# EAGLE design OpampTestBoard (EAGLE 6.5.0)
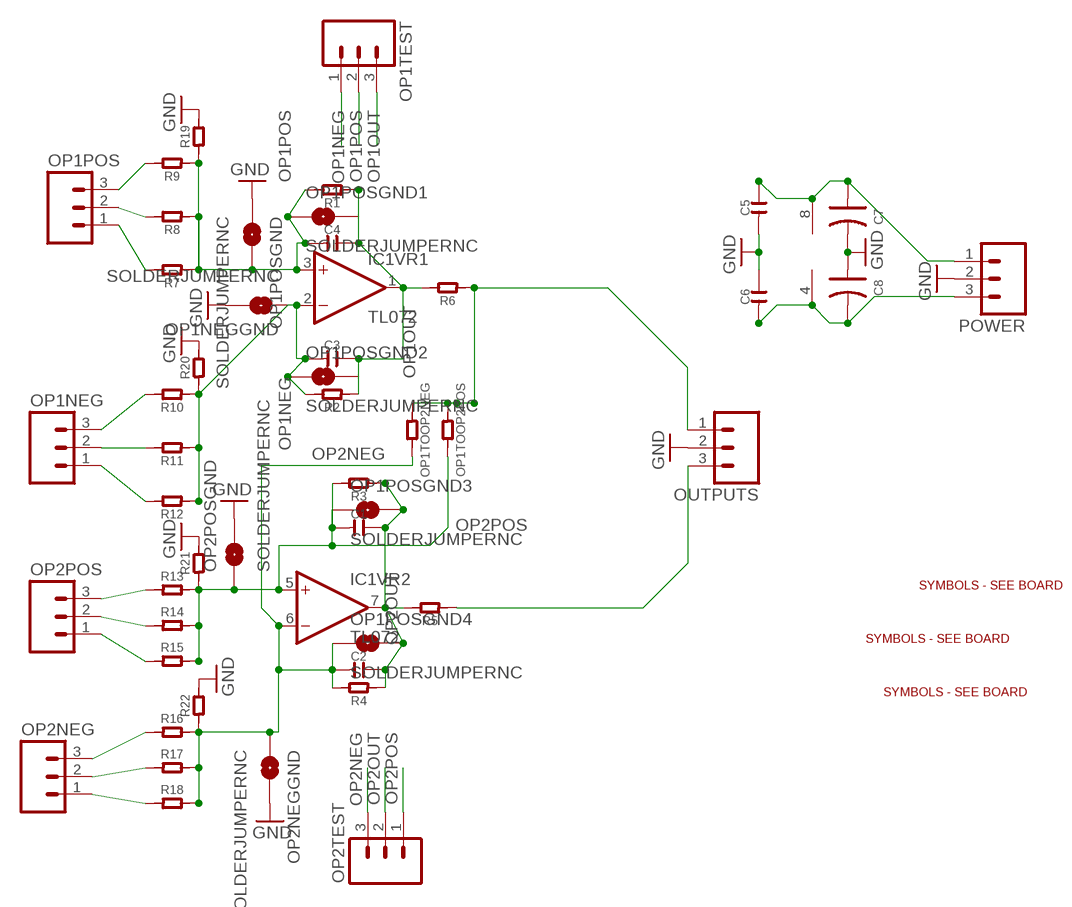
[diagram p0: schematic, sheet 1]

## Parts
C1  C-0805  [C0805]
C2  C-0805  [C0805]
C3  C-0805  [C0805]
C4  C-0805  [C0805]
C5  C-0805  [C0805]
C6  C-0805  [C0805]
C7  C-POLAR-A  [AVX-A]
C8  C-POLAR-A  [AVX-A]
IC1  TL072  [SO08]
OP1NEG  M03PTH  [1X03]
OP1NEGGND  SOLDERJUMPERNC  [SJ_2S]
OP1POS  M03PTH  [1X03]
OP1POSGND  SOLDERJUMPERNC  [SJ_2S]
OP1POSGND1  SOLDERJUMPERNC  [SJ_2S]
OP1POSGND2  SOLDERJUMPERNC  [SJ_2S]
OP1POSGND3  SOLDERJUMPERNC  [SJ_2S]
OP1POSGND4  SOLDERJUMPERNC  [SJ_2S]
OP1TEST  M03PTH  [1X03]
OP1TOOP2NEG  R-0603  [R0603]
OP1TOOP2POS  R-0603  [R0603]
OP2NEG  M03PTH  [1X03]
OP2NEGGND  SOLDERJUMPERNC  [SJ_2S]
OP2POS  M03PTH  [1X03]
OP2POSGND  SOLDERJUMPERNC  [SJ_2S]
OP2TEST  M03PTH  [1X03]
OUTPUTS  M03PTH  [1X03]
POWER  M03PTH  [1X03]
R1  R-0603  [R0603]
R2  R-0603  [R0603]
R3  R-0603  [R0603]
R4  R-0603  [R0603]
R5  R-0603  [R0603]
R6  R-0603  [R0603]
R7  R-0603  [R0603]
R8  R-0603  [R0603]
R9  R-0603  [R0603]
R10  R-0603  [R0603]
R11  R-0603  [R0603]
R12  R-0603  [R0603]
R13  R-0603  [R0603]
R14  R-0603  [R0603]
R15  R-0603  [R0603]
R16  R-0603  [R0603]
R17  R-0603  [R0603]
R18  R-0603  [R0603]
R19  R-0603  [R0603]
R20  R-0603  [R0603]
R21  R-0603  [R0603]
R22  R-0603  [R0603]
U$1  SYMBOLSOPAMP  [SYMB_OPAMP]
U$2  R2  SYMBOLSRESISTOR  [RESISTOR]
U$3  R1  SYMBOLSRESISTOR  [RESISTOR]

## Nets
GND: C5.1 C6.2 C7.- C8.+ OP1NEGGND.2 OP1POSGND.1 OP2NEGGND.2 OP2POSGND.2 OUTPUTS.2 POWER.2 R19.2 R20.2 R21.2 R22.2
N$1: OP1POS.3 R9.2
N$2: OP1TOOP2NEG.1 OP1TOOP2POS.1 OUTPUTS.1 R6.1
N$3: OP1POS.2 R8.2
N$4: OUTPUTS.3 R5.1
N$7: OP1POS.1 R7.2
N$8: OP1NEG.3 R10.2
N$9: OP1NEG.2 R11.2
N$10: OP1NEG.1 R12.2
N$11: OP2POS.3 R13.1
N$12: OP2POS.2 R14.1
N$13: OP2POS.1 R15.1
N$14: OP2NEG.3 R16.1
N$15: OP2NEG.2 R17.1
N$16: OP2NEG.1 R18.1
OP1NEG: C3.1 IC1.2(VR1:-IN) OP1NEGGND.1 OP1POSGND2.1 OP1TEST.1 R2.2 R10.1 R11.1 R12.1 R20.1
OP1OUT: C3.2 C4.2 IC1.1(VR1:OUT) OP1POSGND1.2 OP1POSGND2.2 OP1TEST.3 R1.1 R2.1 R6.2
OP1POS: C4.1 IC1.3(VR1:+IN) OP1POSGND1.1 OP1POSGND.2 OP1TEST.2 R1.2 R7.1 R8.1 R9.1 R19.1
OP2NEG: C2.1 IC1.6(VR2:-IN) OP1POSGND4.1 OP1TOOP2NEG.2 OP2NEGGND.1 OP2TEST.3 R4.2 R16.2 R17.2 R18.2 R22.1
OP2OUT: C1.2 C2.2 IC1.7(VR2:OUT) OP1POSGND3.2 OP1POSGND4.2 OP2TEST.2 R3.1 R4.1 R5.2
OP2POS: C1.1 IC1.5(VR2:+IN) OP1POSGND3.1 OP1TOOP2POS.2 OP2POSGND.1 OP2TEST.1 R3.2 R13.2 R14.2 R15.2 R21.1
VNEG: C6.1 C8.- IC1.4(VR3:V-) POWER.3
VPOS: C5.2 C7.+ IC1.8(VR3:V+) POWER.1

## Library data of the parts
C1-C6 = OPL:C*
C7 C8 = OPL:C-POLAR*
IC1 = EurorackModularParts:TL072
OP1NEG OP1POS OP1TEST OP2NEG OP2POS OP2TEST OUTPUTS POWER = SparkFun-Connectors:M03: Header 3 Standard 3-pin 0.1" header. Use with straight break away headers (SKU : PRT-00116), right angle break away headers (PRT-00553), swiss pins (PRT-00743), machine pins (PRT-00117), and female headers (PRT-00115). Molex polarized connector foot print use with SKU : PRT-08232 with associated crimp pins and housings.
OP1NEGGND OP1POSGND OP1POSGND1-OP1POSGND4 OP2NEGGND OP2POSGND = SparkFun-Passives:SOLDERJUMPER: Solder Jumper Standard SMD solder jumper. Used to automate production. Two varients : Normally Open and Normally Closed are the same, but have different paste layers. NC will have a large amount of paste and should jumper during reflow.
OP1TOOP2NEG OP1TOOP2POS R1-R22 = OPL:R*
U$1-U$3 = EurorackModularParts:SYMBOLS

## Board
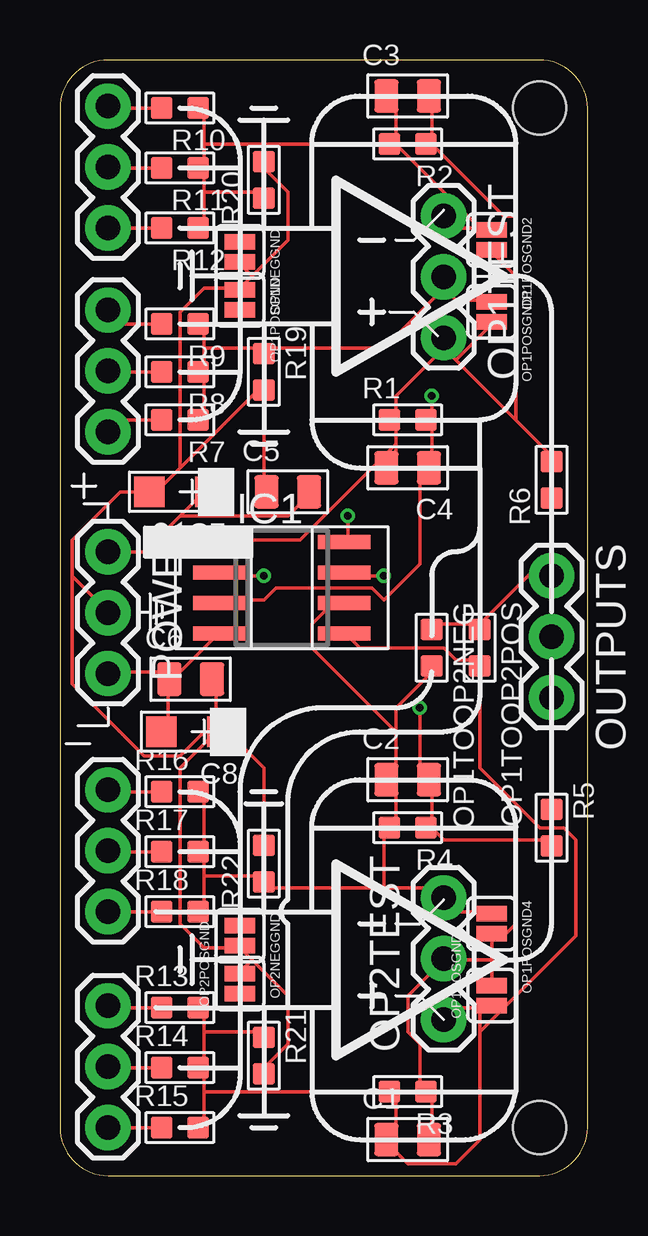
[diagram p1: board, top side]
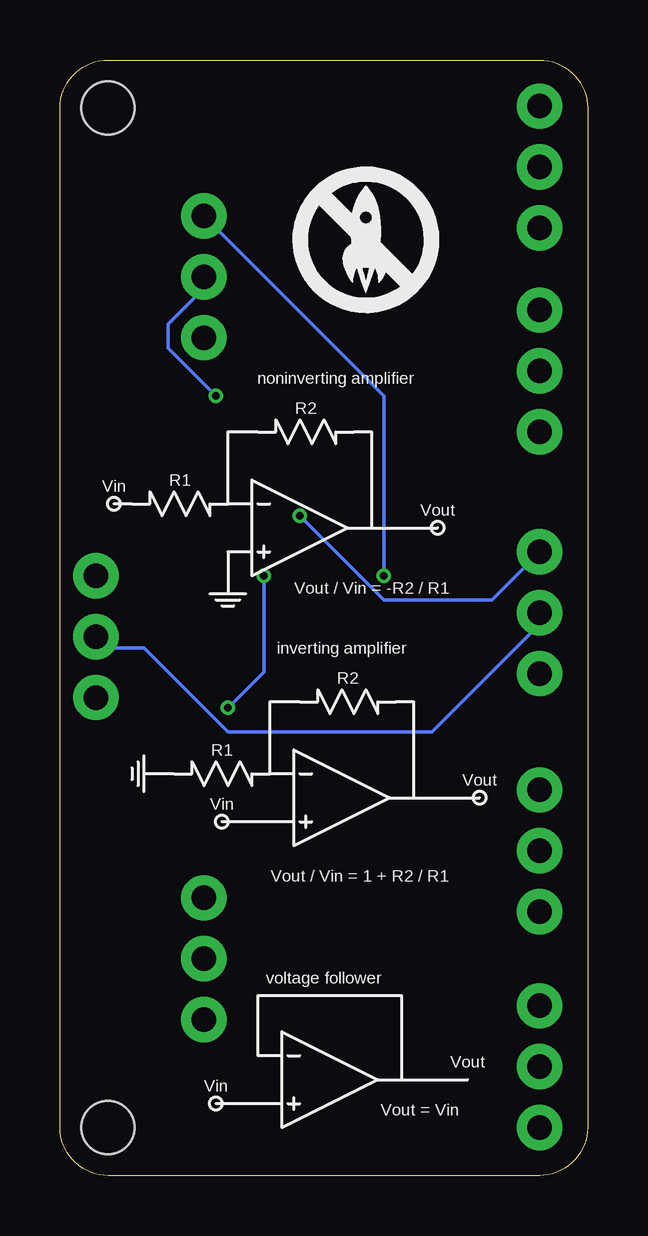
[diagram p2: board, bottom side, seen from below]

Size 22 x 46.5 mm. Coordinates in mm from the lower left corner, seen from the top.
Outline: 0,44.5 0,2 arc90 2,0 20,0 arc90 22,2 22,44.5 arc90 20,46.5 2,46.5 arc90 0,44.5
Copper layers (1*16): Top 0.035mm / dielectric 1.5mm / Bottom 0.035mm
Design rules "ITEADstudio_DRC": minimum track width 6mil, minimum drill 12mil, track to track 6mil, track to pad 6mil, pad to pad 6mil, via to via 6mil, smd to smd 0mil, copper to edge 10mil, drill to drill 10mil, minimum pad ring 10mil, minimum via ring 6mil, stop-mask expansion 2mil, vias tented up to drill 100mil, thermal gap 10mil
Holes 2.2 mm at 20,44.5 20,2

### Footprints (pad centres in the part's own frame; a part is rotated, then mirrored left to right if it is on the bottom)
C0805 = smd 1.016 x 1.397: 1 -0.889,0; 2 0.889,0
AVX-A = smd 1.27 x 1.27: + -1.27,0; - 1.27,0
SO08 = smd 0.6 x 2.2: 1 -1.905,-2.6; 2 -0.635,-2.6; 3 0.635,-2.6; 4 1.905,-2.6; 5 1.905,2.6; 6 0.635,2.6; 7 -0.635,2.6; 8 -1.905,2.6
1X03 = drill 1.016 pad 1.88: 1 0,0; 2 2.54,0; 3 5.08,0
SJ_2S = smd 0.635 x 1.27: 1 -0.412,0; 2 0.412,0
R0603 = smd 0.889 x 0.889: 1 -0.762,0; 2 0.762,0

### Placement (x,y rotation side)
C1  14.5,1.5 0 top
C2  14.5,16.5 0 top
C3  14.5,45 0 top
C4  14.5,29.5 180 top
C5  9.5,28.5 0 top
C6  5.45,20.69 0 top
C7  5,28.5 180 top
C8  5.5,18.5 180 top
IC1  9.25,24.5 270 top
OP1NEG  2,39.5 90 top
OP1NEGGND  7.5,38.5 270 top
OP1POS  2,31 90 top
OP1POSGND  7.5,36.5 270 top
OP1POSGND1  18,36 270 top
OP1POSGND2  18,39 270 top
OP1POSGND3  18,7.5 90 top
OP1POSGND4  18,10.5 270 top
OP1TEST  16,40 270 top
OP1TOOP2NEG  15.5,22 270 top
OP1TOOP2POS  17.5,22 270 top
OP2NEG  2,11 90 top
OP2NEGGND  7.5,10 270 top
OP2POS  2,2 90 top
OP2POSGND  7.5,8 90 top
OP2TEST  16,6.5 90 top
OUTPUTS  20.5,25 270 top
POWER  2,26 270 top
R1  14.5,31.5 0 top
R2  14.5,43 180 top
R3  14.5,3.5 180 top
R4  14.5,14.5 180 top
R5  20.5,14.5 270 top
R6  20.5,29 90 top
R7  5,31.5 180 top
R8  5,33.5 180 top
R9  5,35.5 180 top
R10  5,44.5 180 top
R11  5,42 180 top
R12  5,39.5 180 top
R13  5,7 0 top
R14  5,4.5 0 top
R15  5,2 0 top
R16  5,16 0 top
R17  5,13.5 0 top
R18  5,11 0 top
R19  8.5,33.5 270 top
R20  8.5,41.5 90 top
R21  8.5,5 270 top
R22  8.5,13 90 top
U$1  14,27 0 bottom
U$2  11.75,31 0 bottom
U$3  17,28 0 bottom
U$4  SYMBOLSOPAMP  [SYMB_OPAMP]  12.25,15.75 0 bottom
U$5  R2  [RESISTOR]  10,19.75 0 bottom
U$6  R1  [RESISTOR]  15.25,16.75 0 bottom
U$7  SYMBOLSOPAMP  [SYMB_OPAMP]  12.75,4 0 bottom
U$8  [SMALLROCKET-SILKONLY]  9.25,39 0 bottom

### Tracks (layer width: path | path; a pad name or v marks a point on that pad's centre or on a via)
GND
  Top 0.152: 7.5,9.5 8,9 | 8,9 9.5,7.5 9.5,5.5 8.5,4.5 R21.2 | 8,9 7.5,8.5 OP2POSGND.2 | R22.2 8.5,17 7,18.5 C8.+ 6.5,18.5 | 6.5,18.5 6.5,20.5 C6.2 | 7.5,9.5 6,9.5 5,10.5 5,17 6.5,18.5 | 7.5,9.5 OP2NEGGND.2 | 7.5,37 8,37.5 | 8,37.5 9.5,39 9.5,41 8.5,42 R20.2 | 8,37.5 7.5,38 OP1NEGGND.2 | C5.1 8.5,28.5 R19.2 8.5,33 5,29.5 | 5,29.5 4,28.5 C7.- 2.5,28.5 0.5,26.5 0.5,25 | 7.5,37 6,37 5,36 5,29.5 | 7.5,37 OP1POSGND.1 | 0.5,25 2,23.5 POWER.2 | 6.5,18.5 6,18.5 5,17.5 3.5,17.5 0.5,20.5 0.5,25
  Bottom 0.152: OUTPUTS.2 20.5,22 18.5,22 15,18.5 6.5,18.5 2,23 POWER.2
N$1
  Top 0.152: R9.2 2.5,35.5 2,36 OP1POS.3
N$2
  Top 0.152: 17.5,23 15.5,23 OP1TOOP2NEG.1 | OUTPUTS.1 20.5,26 | 20.5,26 R6.1 | 20.5,26 17.5,23 | 17.5,23 OP1TOOP2POS.1
N$3
  Top 0.152: R8.2 2,33.5 OP1POS.2
N$4
  Top 0.152: OUTPUTS.3 R5.1
N$7
  Top 0.152: R7.2 2.5,31.5 OP1POS.1
N$8
  Top 0.152: R10.2 2,44.5 OP1NEG.3
N$9
  Top 0.152: R11.2 2,42 OP1NEG.2
N$10
  Top 0.152: OP1NEG.1 R12.2
N$11
  Top 0.152: R13.1 2,7 OP2POS.3
N$12
  Top 0.152: R14.1 2,4.5 OP2POS.2
N$13
  Top 0.152: OP2POS.1 R15.1
N$14
  Top 0.152: R16.1 2,16 OP2NEG.3
N$15
  Top 0.152: R17.1 2,13.5 OP2NEG.2
N$16
  Top 0.152: OP2NEG.1 R18.1
OP1NEG  (via drill 0.3)
  Top 0.152: 6,42 6,41 | 6,41 6,39.5 R12.1 | 6,41 7.5,41 | 7.5,41 8.5,41 R20.1 | 6,42 6,43 | 6,43 6,44.5 R10.1 | 6,42 R11.1 | 7.5,41 OP1NEGGND.1 | 14,43 14,45 C3.1 | 17.5,39.5 16.5,39.5 OP1TEST.1 | 17.5,39.5 18,39.5 OP1POSGND2.1 17.5,39.5 | 17.5,39.5 14,43 | 14,43 R2.2 6,43 | v8.5,25 7,25 IC1.2
  Bottom 0.152: v8.5,25 8.5,32.5 OP1TEST.1
OP1OUT
  Top 0.152: 15.5,43 15.5,45 C3.2 | 14,30.5 14,29.5 C4.2 | 14,30.5 14,31.5 | 16,34.5 16.5,34 | 16.5,34 19,31.5 | 19,31.5 20.5,30 R6.2 | 16.5,34 18,35.5 OP1POSGND1.2 | 19,37.5 18,38.5 OP1POSGND2.2 | 19,31.5 19,37.5 | 14,31.5 14,32.5 16,34.5 | 14,31.5 R1.1 | 16,34.5 OP1TEST.3 | 15.5,43 18.5,40 19,40 19,37.5 | 15.5,43 R2.1 | 14,30.5 10,26.5 7,26.5 IC1.1
OP1POS  (via drill 0.3)
  Top 0.152: 15.5,31.5 15.5,29.5 C4.1 15,29.5 15,25.5 13.5,24 13,24.5 9,24.5 8.5,24 7,24 IC1.3 | 6,33.5 6,31.5 R7.1 | 6,33.5 6,34.5 | 6,34.5 6,35.5 R9.1 | 6,33.5 R8.1 | 6,34.5 7.5,34.5 | 7.5,34.5 8.5,34.5 | 7.5,34.5 OP1POSGND.2 | 16,37 16.5,36.5 18,36.5 OP1POSGND1.1 | 8.5,34.5 13.5,34.5 16,37 | 8.5,34.5 R19.1 | 16,37 OP1TEST.2 | v15.5,32.5 15.5,31.5 | 15.5,31.5 R1.2
  Bottom 0.152: v15.5,32.5 17.5,34.5 17.5,35.5 16,37 OP1TEST.2
OP2NEG
  Top 0.152: 14,16.5 14,14.5 R4.2 13.5,14.5 13.5,12 | 14,16.5 14,18.5 | 14,18.5 14,19.5 15.5,21 OP1TOOP2NEG.2 | 14,16.5 C2.1 | 14,18.5 10.5,22 10.5,23 11.5,24 IC1.6 | 6,13.5 6,12.5 | 6,12.5 6,11 R18.2 | 6,12.5 7.5,12.5 | 7.5,12.5 8.5,12.5 R22.1 8.5,12 13.5,12 | 6,13.5 6,16 R16.2 | 6,13.5 R17.2 | 7.5,12.5 OP2NEGGND.1 | OP1POSGND4.1 18,11 16.5,11 16,11.5 OP2TEST.3 16,12 13.5,12
OP2OUT  (via drill 0.3)
  Top 0.152: 18,10 18,9 | 18,9 OP1POSGND3.2 | C1.2 15.5,1.5 15.5,3.5 R3.1 15,3.5 15,5.5 14.5,6 14.5,7.5 16,9 | 16,9 18,9 | 16,9 OP2TEST.2 | 15.5,14.5 15.5,16.5 C2.2 15,16.5 v15,19.5 | 19,14 16,14 15.5,14.5 | 19,14 20.5,14 R5.2 | 15.5,14.5 R4.1 | v13.5,25 12,25 IC1.7 | 18,10 18.5,10 19,10.5 19,14 | 18,10 OP1POSGND4.2
  Bottom 0.152: v13.5,25 13.5,21 v15,19.5
OP2POS
  Top 0.152: IC1.5 12,22.5 12.5,22 16,22 16.5,21.5 17.5,21.5 OP1TOOP2POS.2 17.5,17 20,14.5 21,14.5 21.5,14 21.5,10 17.5,6 | 17.5,7 16.5,7 OP2TEST.1 | 17.5,7 18,7 OP1POSGND3.1 17.5,7 | 6,4.5 6,3.5 | 6,3.5 6,2 R15.2 | 6,4.5 6,6 | 6,6 6,7 R13.2 | 6,4.5 R14.2 | 6,6 7.5,6 | 7.5,6 8.5,6 R21.1 | 7.5,6 OP2POSGND.1 | 6,3.5 R3.2 14,3.5 14,1.5 C1.1 13.5,1.5 14.5,0.5 16.5,0.5 17.5,1.5 17.5,6 | 17.5,6 17.5,7
VNEG
  Top 0.152: C8.- 4.5,18.5 4.5,20.5 C6.1 | C6.1 5,21 6.5,22.5 IC1.4 | POWER.3 2,21 4.5,21 C6.1
VPOS  (via drill 0.3)
  Top 0.152: 5,27.5 3.5,26 POWER.1 | 5,27.5 6,28.5 C7.+ | 5,27.5 9.5,27.5 10,28 10,28.5 C5.2 | v12,27.5 12,26.5 IC1.8
  Bottom 0.152: v12,27.5 8.5,24 4,24 POWER.1

### Text on the board
bPlace: noninverting amplifier | Vout | Vin | Vout / Vin = -R2 / R1 | inverting amplifier | Vout | Vin | Vout / Vin = 1 + R2 / R1 | voltage follower | Vout | Vin | Vout = Vin